# EAGLE design untitled (EAGLE 9.4.2)
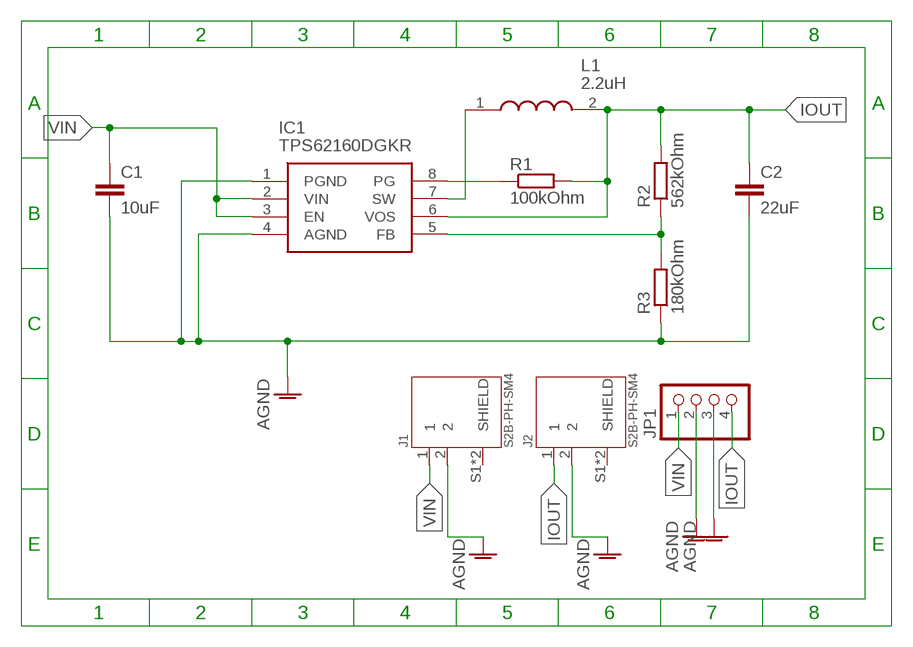
[diagram p0: schematic, sheet 1]

## Parts
C1  10uF  CNC5L1X7R1C106K160AEC1206  [C1206]
C2  22uF  GRM219R61C226ME15KC0805K  [C0805K]
IC1  TPS62160DGKR  [SOP65P490X110-8N]
J1  S2B-PH-SM4  [JST_S2B-PH-SM4-TB(LF)(SN)]
J2  S2B-PH-SM4  [JST_S2B-PH-SM4-TB(LF)(SN)]
JP1  PINHD-1X4  [1X04]
L1  2.2uH  VLS6045EX-1R5N  [INDDFN630X600X450-2N]
R1  100kOhm  RCS1206100KJNEAR1206  [R1206]
R2  562kOhm  ERJ-PB6B5623VR0805  [R0805]
R3  180kOhm  RN73R1ETTP1803D25R0402  [R0402]

## Nets
AGND: C1.2 C2.2 IC1.1(PGND) IC1.4(AGND) J1.2 J2.2 JP1.2 JP1.3 R3.1
FB2: IC1.5(FB) R2.1 R3.2
IOUT: C2.1 IC1.6(VOS) J2.1 JP1.4 L1.2 R1.2 R2.2
PG2: IC1.8(PG) R1.1
SW2: IC1.7(SW) L1.1
VIN: C1.1 IC1.2(VIN) IC1.3(EN) J1.1 JP1.1
Unconnected: J1.S1(SHIELD) J1.S2(SHIELD) J2.S1(SHIELD) J2.S2(SHIELD)

## Library data of the parts
C1 = MouserUseful:CNC5L1X7R1C106K160AE: CAPACITOR, European symbol; MAX: 16V; SPICEPREFIX: C
C2 = MouserUseful:GRM219R61C226ME15K: CAPACITOR, European symbol; MAXV: 16V; SPICEPREFIX: C
IC1 = MouserUseful:TPS62160DGKR: Switching Voltage Regulators 3V-17V 1A Step-Down Converter Source: Datasheet <http://www.ti.com/lit/ds/symlink/tps62160.pdf>; DESCRIPTION: Switching Voltage Regulators 3V-17V 1A Step-Down Converter; HEIGHT: 1.1mm; MANUFACTURER_NAME: Texas Instruments; MANUFACTURER_PART_NUMBER: TPS62160DGKR; MOUSER_PART_NUMBER: 595-TPS62160DGKR; MOUSER_PRICE-STOCK: https://www.mouser.com/Search/Refine.aspx?Keyword=595-TPS62160DGKR
J1 J2 = CommonParts:S2B-PH-SM4: PH Series 2 Position 2 mm Pitch Surface Mount Side Entry Shrouded Header; DESCRIPTION: PH Series 2 Position 2 mm Pitch Surface Mount Side Entry Shrouded Header; DIGI-KEY_PART_NUMBER: 455-1749-1-ND; DIGI-KEY_PURCHASE_URL: https://www.digikey.com/product-detail/en/jst-sales-america-inc/S2B-PH-SM4-TB_LF__SN_/455-1749-1-ND/926846?utm_source=snapeda&utm_medium=aggregator&utm_campaign=symbol; MF: JST Sales; MP: S2B-PH-SM4-TB_LF__SN_; PACKAGE: None
JP1 = pinhead:PINHD-1X4: PIN HEADER
L1 = MouserUseful:VLS6045EX-1R5N: TDK - VLS6045EX-1R5N - INDUCTOR, WIREWOUND, 1.5UH, 5.3A, 30% Source: Datasheet <http://www.mouser.com/ds/2/400/nductor_commercial_power_vls6045ex_en-776394.pdf>; MAXA: 7.5
R1 = MouserUseful:RCS1206100KJNEA: RESISTOR, European symbol; SPICEPREFIX: R; WATT: 0.5
R2 = MouserUseful:ERJ-PB6B5623V: RESISTOR, European symbol
R3 = MouserUseful:RN73R1ETTP1803D25: RESISTOR, European symbol; WATT: 0.5

## Board
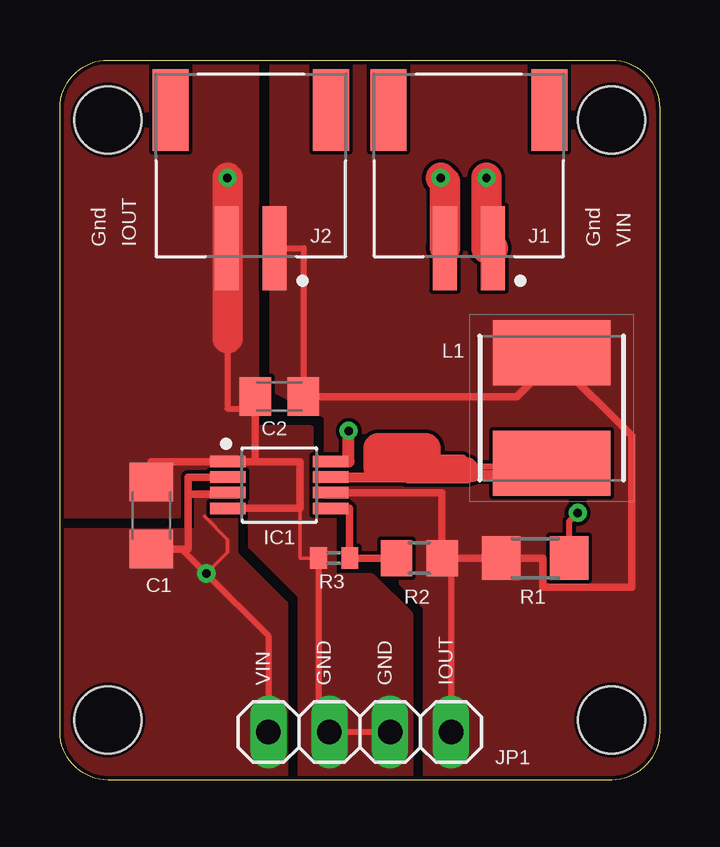
[diagram p1: board, top side]
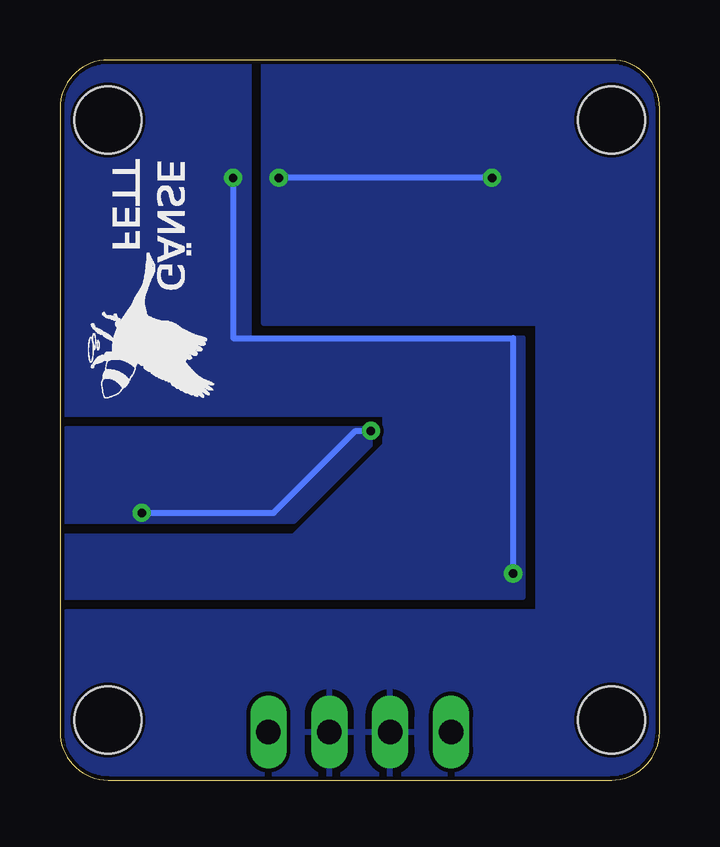
[diagram p2: board, bottom side, seen from below]

Size 25 x 30 mm. Coordinates in mm from the lower left corner, seen from the top.
Outline: 23,0 2,0 arc-90 0,2 0,28 arc-90 2,30 23,30 arc-90 25,28 25,2 arc-90 23,0
Copper layers (1*16): Top 0.035mm / dielectric 1.5mm / Bottom 0.035mm
Design rules "default *": minimum track width 6mil, minimum drill 0.35mm, track to track 6mil, track to pad 6mil, pad to pad 6mil, via to via 6mil, smd to smd 6mil, copper to edge 6mil, drill to drill 6mil, minimum pad ring 10mil, minimum via ring 8mil, stop-mask expansion 4mil, vias tented up to drill 0mil, thermal gap 10mil
Holes 2.8 mm at 2,2.5 23,2.5 2,27.5 23,27.5
bKeepout: area 23,15.9 to 23.1,15.9; area 19,15.9 to 19,15.9; area 22.9,15.9 to 23.2,15.9; area 19,15.9 to 19.1,16; area 22.9,15.9 to 23.1,16; area 23.1,15.9 to 23.2,16; area 19,16 to 19.1,16; area 22.8,16 to 23,16; area 23.1,16 to 23.2,16; area 19,16 to 19.1,16; area 19.2,16 to 19.3,16; area 22.8,16 to 22.9,16; 2280 more areas

### Footprints (pad centres in the part's own frame; a part is rotated, then mirrored left to right if it is on the bottom)
C1206 = smd 1.6 x 1.8: 1 -1.4,0; 2 1.4,0
C0805K = smd 1.3 x 1.6: 1 -1,0; 2 1,0
SOP65P490X110-8N = smd 1.471 x 0.481: 1 -2.15,0.975; 2 -2.15,0.325; 3 -2.15,-0.325; 4 -2.15,-0.975; 5 2.15,-0.975; 6 2.15,-0.325; 7 2.15,0.325; 8 2.15,0.975
JST_S2B-PH-SM4-TB(LF)(SN) = smd 1 x 3.5: 1 -1,0; 2 1,0 | smd 1.5 x 3.4: S1 -3.35,-5.75; S2 3.35,-5.75
1X04 = drill 1.016 long: 1 -3.81,0; 2 -1.27,0; 3 1.27,0; 4 3.81,0
INDPM6060X450N = smd 2.7 x 4.9: 1 -2.3,0; 2 2.3,0
R1206 = smd 1.6 x 1.803: 1 -1.422,0; 2 1.422,0
R0805 = smd 1.3 x 1.5: 1 -0.95,0; 2 0.95,0
R0402 = smd 0.7 x 0.9: 1 -0.65,0; 2 0.65,0

### Placement (x,y rotation side)
C1  3.81,11.03 90 top
C2  9.14,15.98 180 top
IC1  9.14,12.29 0 top
J1  17.05,22.16 180 top
J2  7.96,22.16 180 top
JP1  12.5,2 0 top
L1  VLS6045EX-221M  [INDPM6060X450N]  20.5,15.5 90 top
R1  19.81,9.25 180 top
R2  14.99,9.25 0 top
R3  11.43,9.25 0 top

### Tracks (layer width: path | path; a pad name or v marks a point on that pad's centre or on a via)
AGND  (via drill 0.35)
  Top 0.152: R3.1 10.02,9.25 10.02,11.79
  Top 0.254: R3.1 10.77,2.51 JP1.2 JP1.3 | J2.2 6.99,22.16 6.99,18.41 6.99,15.47 8.14,15.47 C2.2
  Top 0.305: 8.14,13.27 IC1.1 3.81,13.27 C1.2 | 8.14,13.27 C2.2 | R3.1 | 8.14,13.27 10.02,13.27 10.02,11.79 10.02,11.32 IC1.4
  Top 1.27: v15.88,25.09 16.05,24.92 J1.2 | v6.99,25.09 6.99,18.41
  Bottom 0.254: v6.99,25.09 v15.88,25.09
  pour Top (no thermals): 0,11.03 5.08,11.03 5.08,12.93 7.94,12.93 7.94,9.76 10.03,7.67 10.03,0 14.61,0 14.61,6.9 13.02,8.48 11.43,8.48 11.43,10.82 10.48,10.82 10.48,14.65 8.21,14.65 8.21,30.49 0,30.49
  pour Bottom: 16.51,29.84 16.51,19.05 5.08,19.05 5.08,6.99 24.77,6.99 24.77,2 arc-90 22.77,0 2,0 arc-90 0,2 0,28.84 arc-90 1,29.84
FB2
  Top 0.305: R2.1 R3.2 12.08,11.32 IC1.5
IOUT
  Top 0.254: R2.2 16.31,8.87 JP1.4 | J2.1 10.16,22.16 10.16,15.98 | 20,16.93 20,17 20,17.5 20.5,17.5 20.67,17.5
  Top 0.305: IC1.6 15.94,11.97 R2.2 R1.2 20.13,9.25 20.13,8.04 23.84,8.04 23.84,14.33 20.67,17.5 | C2.1 10.16,15.98 19.05,15.98 20,16.93
  Top 0.762: L1.2 20.5,17.5 20,17
  pour Top (no thermals): 8.84,30.35 8.84,16.29 11.11,15.15 11.11,11.34 12.06,11.34 12.06,9.12 13.34,9.12 15.24,7.21 15.24,0 24.08,0 arc90 25.08,1 25.08,29.35 arc90 24.08,30.35
PG2  (via drill 0.35)
  Top 0.254: IC1.8 12.03,13.27 12.04,13.28 | R1.1 21.23,10.78 v21.59,11.13
  Top 0.305: 11.68,13.27 IC1.8
  Top 0.508: 12.04,13.28 v12.04,14.55
  Bottom 0.254: v21.59,11.13 16.09,11.13 12.67,14.55 v12.04,14.55
  pour Bottom: 12.06,14.61 24.77,14.61 24.77,10.79 15.24,10.79 12.06,13.97
SW2
  Top 0.254: 11.22,12.55 13.72,12.55 | 14.48,12.62 14.48,13.06 15.24,13.06 17,13.06 20,13.06 | IC1.7 11.22,12.55 | 11.22,12.55 11.18,12.55 | 17,12.62 17.18,12.8 19.05,12.8 18.87,12.62 17,12.62
  Top 0.406: IC1.7 14.48,12.62
  Top 0.508: 14.48,12.62 17,12.62 | 15.49,13.06 16.76,13.06 16.76,13.31 15.24,13.31
  Top 0.762: L1.1 20.36,13.06 20,13.06 | 17,13.06 17.18,12.87 17.18,12.8
  Top 1.27: 13.27,13.06 13.27,13.82 15.24,13.82 15.24,13.31 15.24,13.06 13.46,13.06
VIN  (via drill 0.35)
  Top 0.152: v6.1,8.6 6.99,9.49 6.99,10.02 6.03,10.98 | IC1.2 6.03,12.62
  Top 0.254: 5.08,9.62 v6.1,8.6 8.69,6.01 JP1.1
  Top 0.305: IC1.3 7.05,11.91 5.33,11.91 | C1.1 5.08,9.62 5.33,9.62 5.33,11.91 | IC1.2 5.33,12.62 5.33,11.91
  Top 1.27: J1.1 17.78,22.16 v17.78,25.09
  Bottom 0.254: v6.1,8.6 6.1,18.41 17.78,18.41 v17.78,25.09
  pour Top (no thermals): 0,10.39 5.71,10.39 5.71,11.98 7.3,11.98 7.3,9.44 9.39,7.35 9.39,0 2,0 arc-90 0,2
  pour Bottom: 17.14,29.84 17.14,18.41 5.71,18.41 5.71,7.62 24.77,7.62 24.77,10.16 15.24,10.16 11.43,13.97 11.43,15.24 24.77,15.24 24.77,29.84

### Text on the board
tNames: Gnd | IOUT | Gnd | VIN | C1 | VIN | GND | GND | IOUT